# Altium schematic sheet Temperature.SchDoc
size 420 x 297 mm; SheetNumber: 3; SheetTotal: 14; PageSetup: Record=PageOptions|CenterHorizontal=True|CenterVertical=True|PrintScale=0.96|XCorrection=1.00|YCorrection=1.00|PrintKind=1|BorderSize=5000000|LeftOffset=0|BottomOffset=0|Orientation=2|PaperLength=4318|PaperWidth=2794|Scale=100|PaperSource=7|PrintQuality=600|MediaType=1|DitherType=10|PaperKind=11" x 17"|PrintScaleMode=1
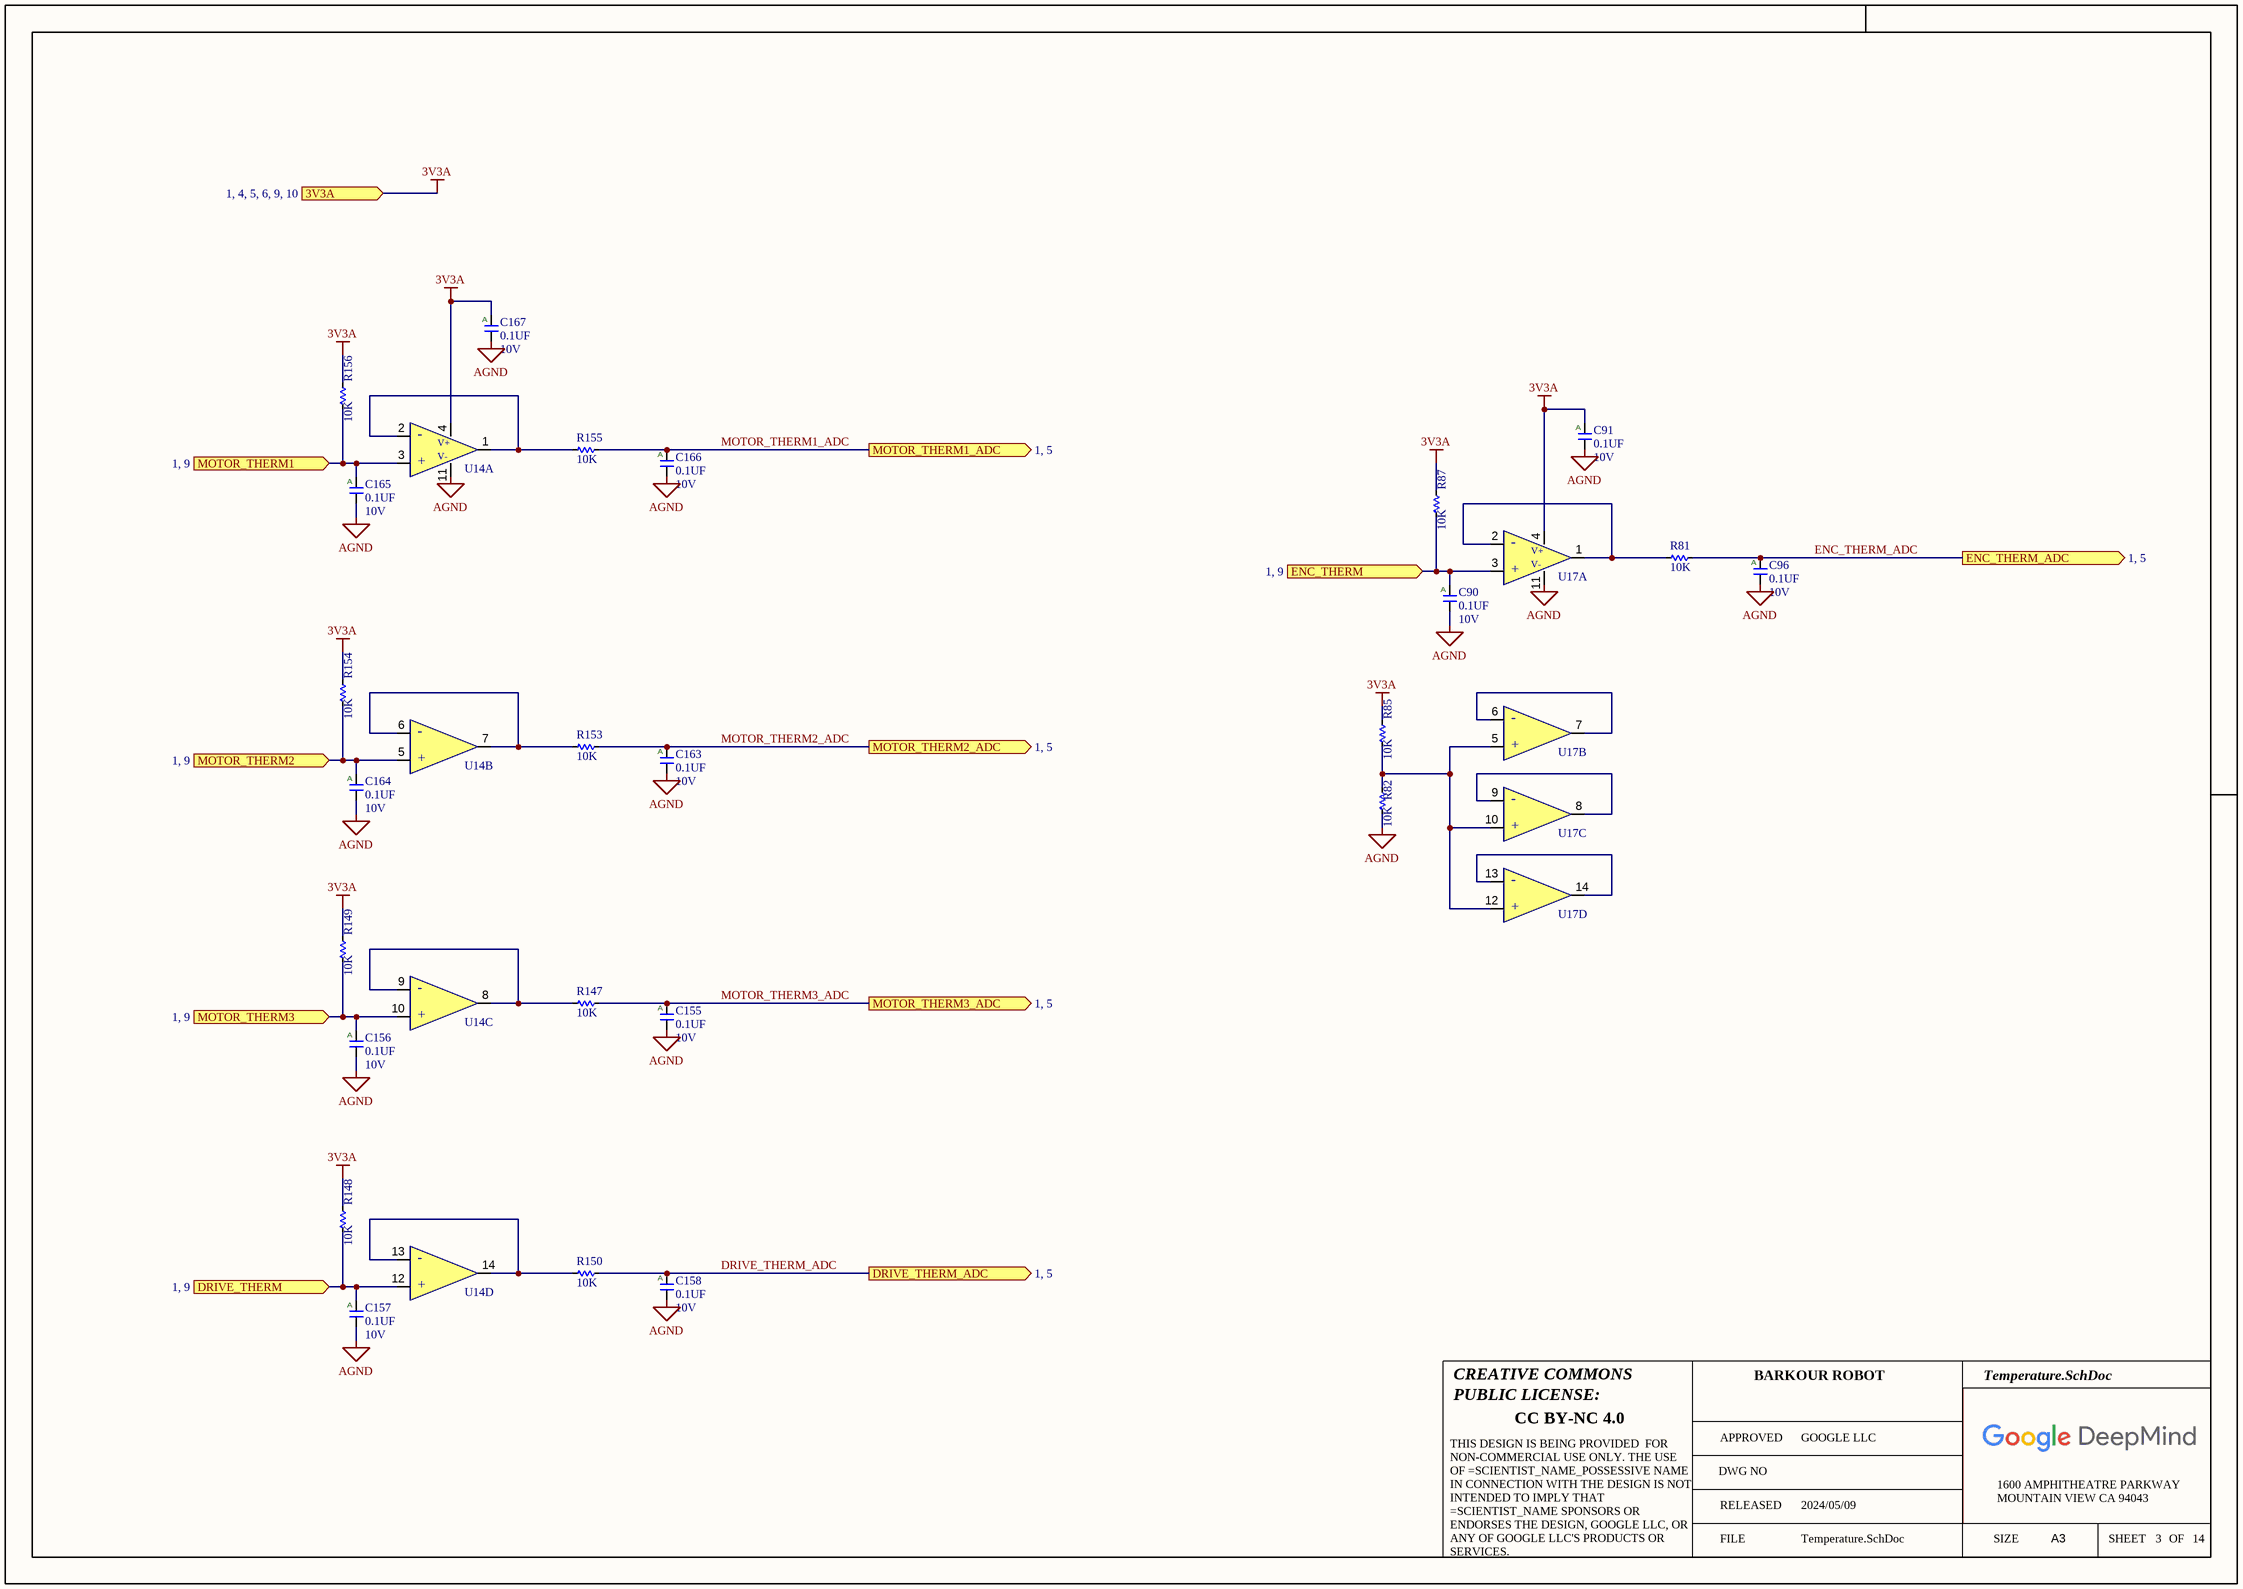
[diagram p0: Temperature.SchDoc]

## Parts
C90  value 0.1UF  Voltage: 10V  [C0201]  (hidden comment: __Template_Cap_Auto)
C91  value 0.1UF  Voltage: 10V  [C0201]  (hidden comment: __Template_Cap_Auto)
C96  value 0.1UF  Voltage: 10V  [C0201]  (hidden comment: __Template_Cap_Auto)
C155  value 0.1UF  Voltage: 10V  [C0201]  (hidden comment: __Template_Cap_Auto)
C156  value 0.1UF  Voltage: 10V  [C0201]  (hidden comment: __Template_Cap_Auto)
C157  value 0.1UF  Voltage: 10V  [C0201]  (hidden comment: __Template_Cap_Auto)
C158  value 0.1UF  Voltage: 10V  [C0201]  (hidden comment: __Template_Cap_Auto)
C163  value 0.1UF  Voltage: 10V  [C0201]  (hidden comment: __Template_Cap_Auto)
C164  value 0.1UF  Voltage: 10V  [C0201]  (hidden comment: __Template_Cap_Auto)
C165  value 0.1UF  Voltage: 10V  [C0201]  (hidden comment: __Template_Cap_Auto)
C166  value 0.1UF  Voltage: 10V  [C0201]  (hidden comment: __Template_Cap_Auto)
C167  value 0.1UF  Voltage: 10V  [C0201]  (hidden comment: __Template_Cap_Auto)
R81  value 10K  [R0201]  (hidden comment: __Template_Resistor)
R82  value 10K  [R0201]  (hidden comment: __Template_Resistor)
R85  value 10K  [R0201]  (hidden comment: __Template_Resistor)
R87  value 10K  [R0201]  (hidden comment: __Template_Resistor)
R147  value 10K  [R0201]  (hidden comment: __Template_Resistor)
R148  value 10K  [R0201]  (hidden comment: __Template_Resistor)
R149  value 10K  [R0201]  (hidden comment: __Template_Resistor)
R150  value 10K  [R0201]  (hidden comment: __Template_Resistor)
R153  value 10K  [R0201]  (hidden comment: __Template_Resistor)
R154  value 10K  [R0201]  (hidden comment: __Template_Resistor)
R155  value 10K  [R0201]  (hidden comment: __Template_Resistor)
R156  value 10K  [R0201]  (hidden comment: __Template_Resistor)
U14  MCP6064  [14TSSOP65]  (value not drawn)  (parts A,B,C,D of 4)
U17  MCP6064  [14TSSOP65]  (value not drawn)  (parts A,B,C,D of 4)

## Ports
3V3A (in, see 1, 4, 5, 6, 9, 10), DRIVE_THERM (in, see 1, 9), DRIVE_THERM_ADC (out, see 1, 5), ENC_THERM (in, see 1, 9), ENC_THERM_ADC (out, see 1, 5), MOTOR_THERM1 (in, see 1, 9), MOTOR_THERM1_ADC (out, see 1, 5), MOTOR_THERM2 (in, see 1, 9), MOTOR_THERM2_ADC (out, see 1, 5), MOTOR_THERM3 (in, see 1, 9), MOTOR_THERM3_ADC (out, see 1, 5)

## Nets
3V3A: C91.1 C167.1 R85.2 R87.2 R148.2 R149.2 R154.2 R156.2 U14.4 U17.4 ; port 3V3A
AGND: C90.2 C91.2 C96.2 C155.2 C156.2 C157.2 C158.2 C163.2 C164.2 C165.2 C166.2 C167.2 R82.1 U14.11 U17.11
DRIVE_THERM: C157.1 R148.1 U14.12 ; port DRIVE_THERM
DRIVE_THERM_ADC: C158.1 R150.2 ; port DRIVE_THERM_ADC
ENC_THERM: C90.1 R87.1 U17.3 ; port ENC_THERM
ENC_THERM_ADC: C96.1 R81.2 ; port ENC_THERM_ADC
MOTOR_THERM1: C165.1 R156.1 U14.3 ; port MOTOR_THERM1
MOTOR_THERM1_ADC: C166.1 R155.2 ; port MOTOR_THERM1_ADC
MOTOR_THERM2: C164.1 R154.1 U14.5 ; port MOTOR_THERM2
MOTOR_THERM2_ADC: C163.1 R153.2 ; port MOTOR_THERM2_ADC
MOTOR_THERM3: C156.1 R149.1 U14.10 ; port MOTOR_THERM3
MOTOR_THERM3_ADC: C155.1 R147.2 ; port MOTOR_THERM3_ADC
NetR81_1: R81.1 U17.1 U17.2
NetR82_2: R82.2 R85.1 U17.5 U17.10 U17.12
NetR147_1: R147.1 U14.8 U14.9
NetR150_1: R150.1 U14.13 U14.14
NetR153_1: R153.1 U14.6 U14.7
NetR155_1: R155.1 U14.1 U14.2
NetU17_6: U17.6 U17.7
NetU17_8: U17.8 U17.9
NetU17_13: U17.13 U17.14

## Notes on the sheet
- CREATIVE COMMONS
- PUBLIC LICENSE:
- BARKOUR ROBOT
- CC BY-NC 4.0
- APPROVED
- DWG NO
- GOOGLE LLC
- FILE
- RELEASED
- 2024/05/09
- SIZE
- 1600 AMPHITHEATRE PARKWAY
- MOUNTAIN VIEW CA 94043
- A3
- SHEET
- OF
- THIS DESIGN IS BEING PROVIDED  FOR NON-COMMERCIAL USE ONLY. THE USE OF =SCIENTIST_NAME_POSSESSIVE NAME IN CONNECTION WITH THE DESIGN IS NOT INTENDED TO IMPLY THAT =SCIENTIST_NAME SPONSORS OR ENDORSES THE DESIGN, GOOGLE LLC, OR ANY OF GOOGLE LLC'S PRODUCTS OR SERVICES.
- (in symbol 934) A
- (in symbol MICROCHIP_MCP6064, part A) -; V+; V-; +
- (in symbol MICROCHIP_MCP6064, part B) -; +
- (in symbol MICROCHIP_MCP6064, part C) -; +
- (in symbol MICROCHIP_MCP6064, part D) -; +

## Library data of the parts
C90 C91 C96 C155-C158 C163-C167 = 934: CAP, CER, X6S, 0.1uF, 10V, 10%, 0201, AUTOGRADE; MFG: MURATA; MFG P/N: GRT033C81A104KE01D; COMMON: 150-01178-00; Status: Released; Package: 0201; Supplier 1: Digi-key; ComponentLink1URL: https://search.murata.co.jp/Ceramy/image/img/A01X/G101/ENG/GRT033C81A104KE01-01.pdf; Supplier Part Number 1: 490-12232-1-ND
R81 R82 R85 R87 R147-R150 R153-R156 = 6783: RES, 10K, 1%, 1/20W, 0201, AUTOGRADE; MFG: PANASONIC; MFG P/N: ERJ1GNF1002C; COMMON: 470-00033-00; Status: Released; Package: 0201; Supplier 1: Digi-Key; ComponentLink1URL: https://industrial.panasonic.com/cdbs/www-data/pdf/RDA0000/AOA0000C304.pdf; Supplier Part Number 1: P122414CT-ND
U14 U17 = MICROCHIP_MCP6064: Microchip MCP6064-E/ST; Quad Op Amp; 0.73MHz CMOS; Rail to Rail; 3V; 5V; 14-Pin TSSOP; MFG: Microchip Technology; ComponentLink1URL: http://www.microchip.com/mymicrochip/filehandler.aspx?ddocname=en528763; Supplier 1: Digi-Key; Supplier Part Number 1: MCP6064-E/ST-ND; MFG P/N: MCP6064-E/ST; Value: MCP6064